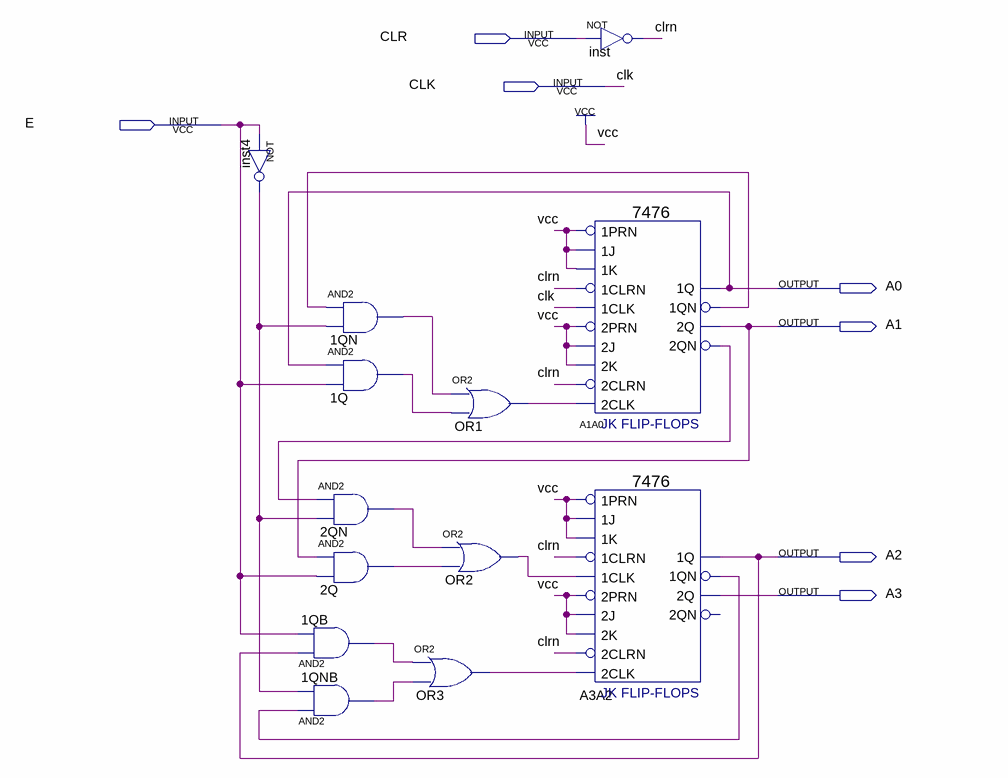
[diagram p0: schematic sheet]
// Quartus schematic Question3alt.bdf as structural Verilog: 13 symbols, 7 pins
module Question3alt (
  input  CLR,
  input  CLK,
  input  E,
  output A0,
  output A1,
  output A2,
  output A3
);

  wire A1A0_1qn, A1A0_2qn, A3A2_1qn, clrn, inst4_out, n1Q_out, n1QB_out, n1QN_out, n1QNB_out, n2Q_out,
       n2QN_out, OR1_out, OR2_out, OR3_out;

  not inst4 (inst4_out, E);
  and u_1QN (n1QN_out, A1A0_1qn, inst4_out);
  and u_1Q (n1Q_out, A0, E);
  and u_2QN (n2QN_out, A1A0_2qn, inst4_out);
  and u_2Q (n2Q_out, A1, E);
  and u_1QB (n1QB_out, A2, E);
  and u_1QNB (n1QNB_out, A3A2_1qn, inst4_out);
  or OR3 (OR3_out, n1QB_out, n1QNB_out);
  or OR1 (OR1_out, n1QN_out, n1Q_out);
  or OR2 (OR2_out, n2QN_out, n2Q_out);
  not inst (clrn, CLR);
  \7476  A1A0 (
    .\1J (1'b1), .\1K (1'b1), .\1PRN (1'b1), .\2PRN (1'b1), .\2J (1'b1), .\1CLK (CLK), .\1CLRN (clrn),
    .\2K (1'b1), .\2CLRN (clrn), .\2CLK (OR1_out), .\2QN (A1A0_2qn), .\1Q (A0), .\2Q (A1), .\1QN (A1A0_1qn));
  \7476  A3A2 (
    .\1J (1'b1), .\1K (1'b1), .\1PRN (1'b1), .\2PRN (1'b1), .\2J (1'b1), .\1CLK (OR2_out), .\1CLRN (clrn),
    .\2K (1'b1), .\2CLRN (clrn), .\2CLK (OR3_out), .\1Q (A2), .\2Q (A3), .\1QN (A3A2_1qn));  // open: 2QN
endmodule
